# Altium schematic sheet TIDA-010933-DCDC-CLLLC.SchDoc
size 431 x 279 mm; Date: Not shown in title block; ApprovedBy: Not shown in title block; CheckedBy: Not shown in title block; Author: Not shown in title block; CompanyName: Not shown in title block; Engineer: Not shown in title block; Organization: Not shown in title block; Address1: Not shown in title block; Address2: Not shown in title block; Address3: Not shown in title block; Address4: Not shown in title block; DocumentNumber: 1; Revision: Use project parameter SCH_Rev; SheetNumber: 3; SheetTotal: 11; PageSetup: Record=PageOptions|CenterHorizontal=True|CenterVertical=True|PrintScale=1.00|XCorrection=1.00|YCorrection=1.00|PrintKind=0|BorderSize=5000000|LeftOffset=0|BottomOffset=0|Orientation=2|PaperLength=1000|PaperWidth=1000|Scale=100|PaperSource=15|PrintQuality=600|MediaType=1|DitherType=10|PaperKind=Letter|PrintScaleMode=1; CurrentTime: Not shown in title block; CurrentDate: Not shown in title block; Time: Not shown in title block; DocumentFullPathAndName: Not shown in title block; DocumentName: Not shown in title block; ModifiedDate: 1/25/2022; ImagePath: Not shown in title block
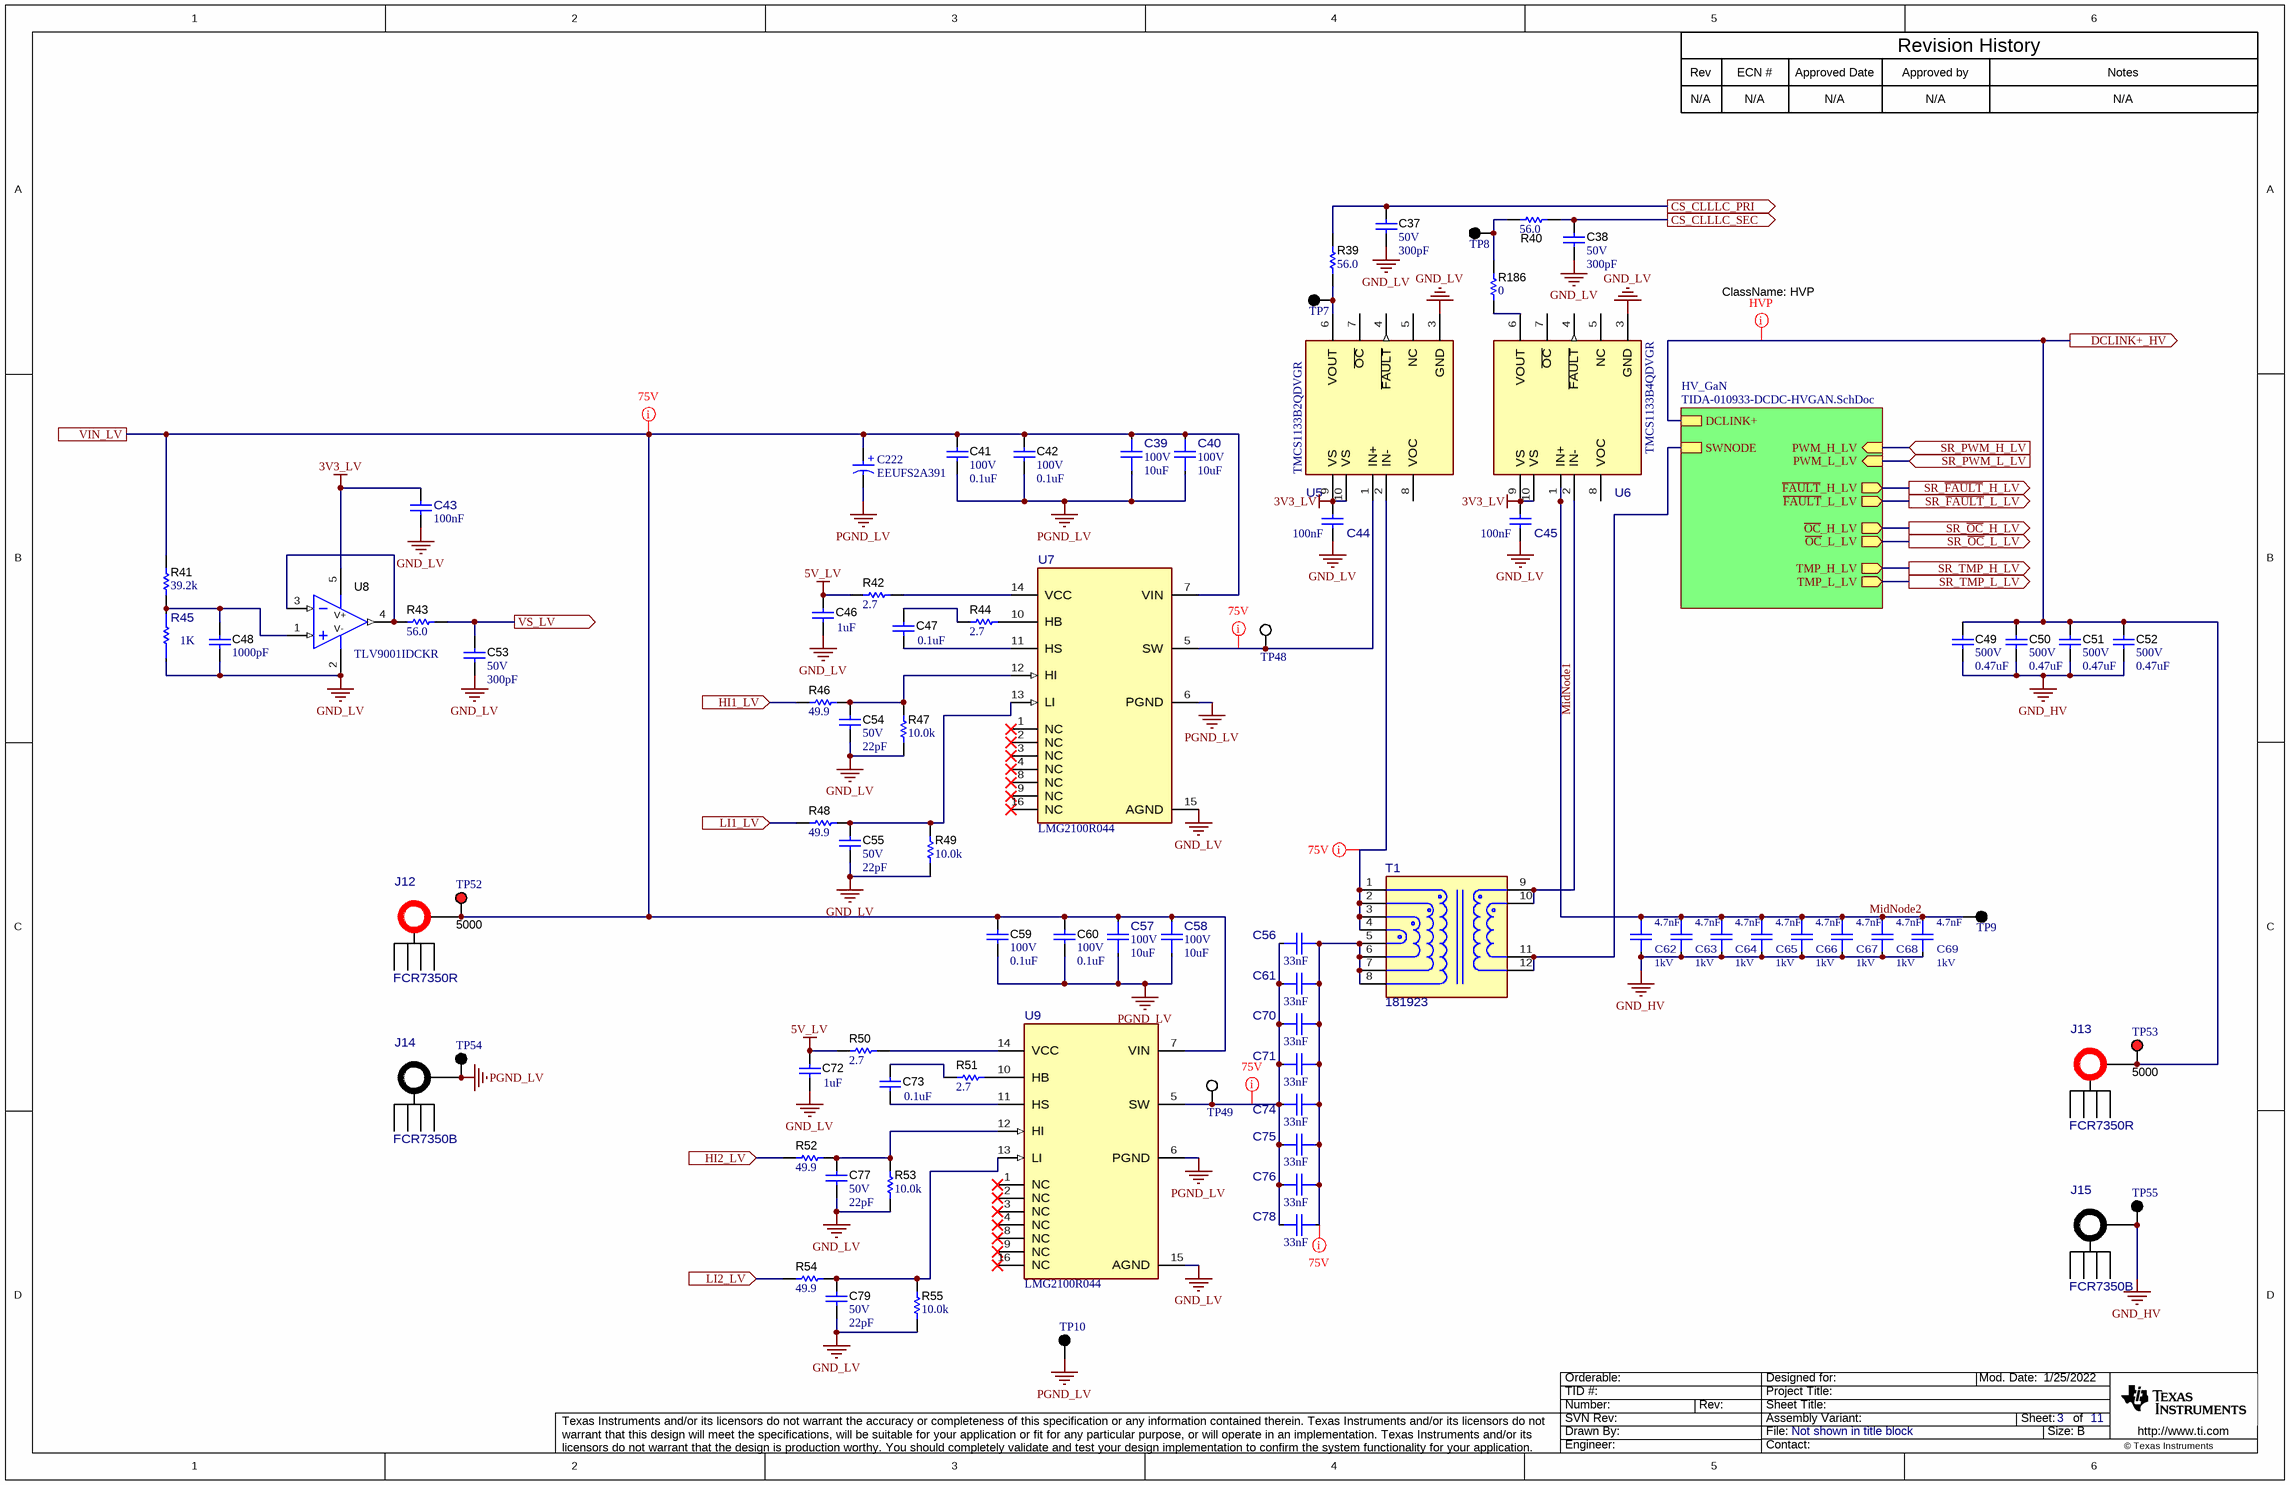
[diagram p0: TIDA-010933-DCDC-CLLLC.SchDoc]

## Parts
C37  VDC_V: 50V  ValueDisplayed: 300pF  [0402]  (hidden comment: GRM1555C1H301JA01D)
C38  VDC_V: 50V  ValueDisplayed: 300pF  [0402]  (hidden comment: GRM1555C1H301JA01D)
C39  VDC_V: 100V  ValueDisplayed: 10uF  [FP-C3225X7R2A106K250AC_1210-MFG]  (hidden comment: C3225X7R2A106K250AC)
C40  VDC_V: 100V  ValueDisplayed: 10uF  [FP-C3225X7R2A106K250AC_1210-MFG]  (hidden comment: C3225X7R2A106K250AC)
C41  VDC_V: 100V  ValueDisplayed: 0.1uF  [0402]  (hidden comment: GRM155R62A104KE14D)
C42  VDC_V: 100V  ValueDisplayed: 0.1uF  [0402]  (hidden comment: GRM155R62A104KE14D)
C43  Cap_F: 100nF  [FP-CL10B104KB8NNNC_0603-IPC_B]  (hidden comment: CL10B104KB8NNNC)
C44  Cap_F: 100nF  [FP-CL10B104KB8NNNC_0603-IPC_B]  (hidden comment: CL10B104KB8NNNC)
C45  Cap_F: 100nF  [FP-CL10B104KB8NNNC_0603-IPC_B]  (hidden comment: CL10B104KB8NNNC)
C46  ValueDisplayed: 1uF  [0402]  (hidden comment: GRM155R61E105KA12D)
C47  ValueDisplayed: 0.1uF  [0402]  (hidden comment: GRM155R71E104KE14D)
C48  ValueDisplayed: 1000pF  [0603]  (hidden comment: CC0603JRNPO8BN102)
C49  VDC_V: 500V  ValueDisplayed: 0.47uF  [1812_254]  (hidden comment: 1812Y5000474KXTWS2)
C50  VDC_V: 500V  ValueDisplayed: 0.47uF  [1812_254]  (hidden comment: 1812Y5000474KXTWS2)
C51  VDC_V: 500V  ValueDisplayed: 0.47uF  [1812_254]  (hidden comment: 1812Y5000474KXTWS2)
C52  VDC_V: 500V  ValueDisplayed: 0.47uF  [1812_254]  (hidden comment: 1812Y5000474KXTWS2)
C53  VDC_V: 50V  ValueDisplayed: 300pF  [0402]  (hidden comment: GRM1555C1H301JA01D)
C54  VDC_V: 50V  ValueDisplayed: 22pF  [0402]  (hidden comment: CC0402JRNPO9BN220)
C55  VDC_V: 50V  ValueDisplayed: 22pF  [0402]  (hidden comment: CC0402JRNPO9BN220)
C56  ValueDisplayed: 33nF  [FP-C3225C0G2A333J200AA_1210-MFG]  (hidden comment: C3225C0G2A333J200AA)
C57  VDC_V: 100V  ValueDisplayed: 10uF  [FP-C3225X7R2A106K250AC_1210-MFG]  (hidden comment: C3225X7R2A106K250AC)
C58  VDC_V: 100V  ValueDisplayed: 10uF  [FP-C3225X7R2A106K250AC_1210-MFG]  (hidden comment: C3225X7R2A106K250AC)
C59  VDC_V: 100V  ValueDisplayed: 0.1uF  [0402]  (hidden comment: GRM155R62A104KE14D)
C60  VDC_V: 100V  ValueDisplayed: 0.1uF  [0402]  (hidden comment: GRM155R62A104KE14D)
C61  ValueDisplayed: 33nF  [FP-C3225C0G2A333J200AA_1210-MFG]  (hidden comment: C3225C0G2A333J200AA)
C62  ValueDisplayed: 4.7nF  VDC_V: 1kV  [FP-C3225C0G3A472J200AC_1210-MFG]  (hidden comment: C3225C0G3A472J200AC)
C63  ValueDisplayed: 4.7nF  VDC_V: 1kV  [FP-C3225C0G3A472J200AC_1210-MFG]  (hidden comment: C3225C0G3A472J200AC)
C64  ValueDisplayed: 4.7nF  VDC_V: 1kV  [FP-C3225C0G3A472J200AC_1210-MFG]  (hidden comment: C3225C0G3A472J200AC)
C65  ValueDisplayed: 4.7nF  VDC_V: 1kV  [FP-C3225C0G3A472J200AC_1210-MFG]  (hidden comment: C3225C0G3A472J200AC)
C66  ValueDisplayed: 4.7nF  VDC_V: 1kV  [FP-C3225C0G3A472J200AC_1210-MFG]  (hidden comment: C3225C0G3A472J200AC)
C67  ValueDisplayed: 4.7nF  VDC_V: 1kV  [FP-C3225C0G3A472J200AC_1210-MFG]  (hidden comment: C3225C0G3A472J200AC)
C68  ValueDisplayed: 4.7nF  VDC_V: 1kV  [FP-C3225C0G3A472J200AC_1210-MFG]  (hidden comment: C3225C0G3A472J200AC)
C69  ValueDisplayed: 4.7nF  VDC_V: 1kV  [FP-C3225C0G3A472J200AC_1210-MFG]  (hidden comment: C3225C0G3A472J200AC)
C70  ValueDisplayed: 33nF  [FP-C3225C0G2A333J200AA_1210-MFG]  (hidden comment: C3225C0G2A333J200AA)
C71  ValueDisplayed: 33nF  [FP-C3225C0G2A333J200AA_1210-MFG]  (hidden comment: C3225C0G2A333J200AA)
C72  ValueDisplayed: 1uF  [0402]  (hidden comment: GRM155R61E105KA12D)
C73  ValueDisplayed: 0.1uF  [0402]  (hidden comment: GRM155R71E104KE14D)
C74  ValueDisplayed: 33nF  [FP-C3225C0G2A333J200AA_1210-MFG]  (hidden comment: C3225C0G2A333J200AA)
C75  ValueDisplayed: 33nF  [FP-C3225C0G2A333J200AA_1210-MFG]  (hidden comment: C3225C0G2A333J200AA)
C76  ValueDisplayed: 33nF  [FP-C3225C0G2A333J200AA_1210-MFG]  (hidden comment: C3225C0G2A333J200AA)
C77  VDC_V: 50V  ValueDisplayed: 22pF  [0402]  (hidden comment: CC0402JRNPO9BN220)
C78  ValueDisplayed: 33nF  [FP-C3225C0G2A333J200AA_1210-MFG]  (hidden comment: C3225C0G2A333J200AA)
C79  VDC_V: 50V  ValueDisplayed: 22pF  [0402]  (hidden comment: CC0402JRNPO9BN220)
C222  EEUFS2A391  [WCAP-ATUL_D16H25]
J12  FCR7350R  [FP-FCR7350R_CONN_BANANA_JACK-MFG]
J13  FCR7350R  [FP-FCR7350R_CONN_BANANA_JACK-MFG]
J14  FCR7350B  [FP-FCR7350B_CONN_BANANA_JACK-MFG]
J15  FCR7350B  [FP-FCR7350B_CONN_BANANA_JACK-MFG]
R39  ValueDisplayed: 56.0  [0603]  (hidden comment: RC0603FR-0756RL)
R40  ValueDisplayed: 56.0  [0603]  (hidden comment: RC0603FR-0756RL)
R41  ValueDisplayed: 39.2k  [0603]  (hidden comment: RT0603BRD0739K2L)
R42  ValueDisplayed: 2.7  [0402]  (hidden comment: CRCW04022R70JNED)
R43  ValueDisplayed: 56.0  [0603]  (hidden comment: RC0603FR-0756RL)
R44  ValueDisplayed: 2.7  [0402]  (hidden comment: CRCW04022R70JNED)
R45  value 1K  [FP-RT0603BRD071KL_0603-MFG]  (hidden comment: RT0603BRD071KL)
R46  ValueDisplayed: 49.9  [0402]  (hidden comment: RC0402FR-0749R9L)
R47  ValueDisplayed: 10.0k  [0402]  (hidden comment: RC0402FR-0710KL)
R48  ValueDisplayed: 49.9  [0402]  (hidden comment: RC0402FR-0749R9L)
R49  ValueDisplayed: 10.0k  [0402]  (hidden comment: RC0402FR-0710KL)
R50  ValueDisplayed: 2.7  [0402]  (hidden comment: CRCW04022R70JNED)
R51  ValueDisplayed: 2.7  [0402]  (hidden comment: CRCW04022R70JNED)
R52  ValueDisplayed: 49.9  [0402]  (hidden comment: RC0402FR-0749R9L)
R53  ValueDisplayed: 10.0k  [0402]  (hidden comment: RC0402FR-0710KL)
R54  ValueDisplayed: 49.9  [0402]  (hidden comment: RC0402FR-0749R9L)
R55  ValueDisplayed: 10.0k  [0402]  (hidden comment: RC0402FR-0710KL)
R186  ValueDisplayed: 0  [0603]  (hidden comment: RC0603JR-070RL)
T1  181923  [FP-181923_PTH_TRANSFORMER_74MM0_60MM0-MFG]
TP7  5001  [Keystone5001]  (value not drawn)
TP8  5001  [Keystone5001]  (value not drawn)
TP9  5001  [Keystone5001]  (value not drawn)
TP10  5001  [Keystone5001]  (value not drawn)
TP48  5015  [Testpoint_Keystone_Miniature]  (value not drawn)
TP49  5015  [Testpoint_Keystone_Miniature]  (value not drawn)
TP52  5000  [Keystone5000]
TP53  5000  [Keystone5000]
TP54  5001  [Keystone5001]  (value not drawn)
TP55  5001  [Keystone5001]  (value not drawn)
U5  TMCS1133B2QDVGR  [DVG0010A-MFG]
U6  TMCS1133B4QDVGR  [DVG0010A-MFG]
U7  LMG2100R044  [VBN0016A-MFG]
U8  TLV9001IDCKR  [DCK0005A_N]
U9  LMG2100R044  [VBN0016A-MFG]

## Sub-sheets
HV_GaN = TIDA-010933-DCDC-HVGAN.SchDoc: SWNODE, DCLINK+, ~{FAULT}_H_LV (out), ~{FAULT}_L_LV (out), ~{OC}_H_LV (out), ~{OC}_L_LV (out), PWM_H_LV (in), PWM_L_LV (in), TMP_H_LV (out), TMP_L_LV (out)

## Ports
CS_CLLLC_PRI (out), CS_CLLLC_SEC (out), DCLINK+_HV (out), HI1_LV (in), HI2_LV (in), LI1_LV (in), LI2_LV (in), SR_PWM_H_LV (in), SR_PWM_L_LV (in), SR_TMP_H_LV (out), SR_TMP_L_LV (out), SR_~{FAULT}_H_LV (out), SR_~{FAULT}_L_LV (out), SR_~{OC}_H_LV (out), SR_~{OC}_L_LV (out), VIN_LV, VS_LV (out)

## Nets
3V3_LV: C43.1 C44.1 C45.1 U5.9(VS) U5.10(VS) U6.9(VS) U6.10(VS) U8.5(V+)
5V_LV: C46.1 C72.1 R42.1 R50.1
GND_HV: C49.2 C50.2 C51.2 C52.2 C62.2 C63.2 C64.2 C65.2 C66.2 C67.2 C68.2 C69.2 J15.1 TP55.1
GND_LV: C37.2 C38.2 C43.2 C44.2 C45.2 C46.2 C48.2 C53.2 C54.2 C55.2 C72.2 C77.2 C79.2 R45.1 R47.1 R49.1 R53.1 R55.1 U5.3(GND) U6.3(GND) U7.15(AGND) U8.2(V-) U9.15(AGND)
PGND_LV: C39.1 C40.1 C41.2 C42.2 C57.1 C58.1 C59.2 C60.2 C222.2(N) J14.1 TP10.1 TP54.1 U7.6(PGND) U9.6(PGND)
CS_CLLLC_PRI: C37.1 R39.2 ; port CS_CLLLC_PRI
CS_CLLLC_SEC: C38.1 R40.1 ; port CS_CLLLC_SEC
DCLINK+_HV: C49.1 C50.1 C51.1 C52.1 J13.1 TP53.1 ; port DCLINK+_HV, sheet HV_GaN/DCLINK+
HI1_LV: R46.1 ; port HI1_LV
HI2_LV: R52.1 ; port HI2_LV
LI1_LV: R48.1 ; port LI1_LV
LI2_LV: R54.1 ; port LI2_LV
MidNode1: T1.9 T1.10 U6.2(IN-)
MidNode2: C62.1 C63.1 C64.1 C65.1 C66.1 C67.1 C68.1 C69.1 TP9.1 U6.1(IN+)
SR_~{FAULT}_H_LV: port SR_~{FAULT}_H_LV, sheet HV_GaN/~{FAULT}_H_LV
SR_~{FAULT}_L_LV: port SR_~{FAULT}_L_LV, sheet HV_GaN/~{FAULT}_L_LV
SR_~{OC}_H_LV: port SR_~{OC}_H_LV, sheet HV_GaN/~{OC}_H_LV
SR_~{OC}_L_LV: port SR_~{OC}_L_LV, sheet HV_GaN/~{OC}_L_LV
SR_PWM_H_LV: port SR_PWM_H_LV, sheet HV_GaN/PWM_H_LV
SR_PWM_L_LV: port SR_PWM_L_LV, sheet HV_GaN/PWM_L_LV
SR_TMP_H_LV: port SR_TMP_H_LV, sheet HV_GaN/TMP_H_LV
SR_TMP_L_LV: port SR_TMP_L_LV, sheet HV_GaN/TMP_L_LV
VIN_LV: C39.2 C40.2 C41.1 C42.1 C57.2 C58.2 C59.1 C60.1 C222.1(P) J12.1 R41.2 TP52.1 U7.7(VIN) U9.7(VIN) ; port VIN_LV
VS_LV: C53.1 R43.2 ; port VS_LV
NetC47_1: C47.1 R44.1
NetC47_2: C47.2 U7.11(HS)
NetC48_1: C48.1 R41.1 R45.2 U8.1(IN+)
NetC54_1: C54.1 R46.2 R47.2 U7.12(HI)
NetC55_1: C55.1 R48.2 R49.2 U7.13(LI)
NetC56_1: C56.1 C61.1 C70.1 C71.1 C74.1 C75.1 C76.1 C78.1 T1.5 T1.6 T1.7 T1.8
NetC56_2: C56.2 C61.2 C70.2 C71.2 C74.2 C75.2 C76.2 C78.2 TP49.1 U9.5(SW)
NetC73_1: C73.1 R51.1
NetC73_2: C73.2 U9.11(HS)
NetC77_1: C77.1 R52.2 R53.2 U9.12(HI)
NetC79_1: C79.1 R54.2 R55.2 U9.13(LI)
NetR39_1: R39.1 TP7.1 U5.6(VOUT)
NetR40_2: R40.2 R186.2 TP8.1
NetR42_2: R42.2 U7.14(VCC)
NetR43_1: R43.1 U8.3(IN-) U8.4(OUT)
NetR44_2: R44.2 U7.10(HB)
NetR50_2: R50.2 U9.14(VCC)
NetR51_2: R51.2 U9.10(HB)
NetR186_1: R186.1 U6.6(VOUT)
NetT1_1: T1.1 T1.2 T1.3 T1.4 U5.2(IN-)
NetT1_11: T1.11 T1.12 ; sheet HV_GaN/SWNODE
NetTP48_1: TP48.1 U5.1(IN+) U7.5(SW)

Not connected (* = marked no-connect by the designer): J12 2(MNT_1) 3(MNT_2) 4(MNT_3) 5(MNT_4); J13 2(MNT_1) 3(MNT_2) 4(MNT_3) 5(MNT_4); J14 2(MNT_1) 3(MNT_2) 4(MNT_3) 5(MNT_4); J15 2(MNT_1) 3(MNT_2) 4(MNT_3) 5(MNT_4); U5 4(~{FAULT}) 5(NC) 7(~{OC}) 8(VOC); U6 4(~{FAULT}) 5(NC) 7(~{OC}) 8(VOC); U7 1(NC)* 2(NC)* 3(NC)* 4(NC)* 8(NC)* 9(NC)* 16(NC)*; U9 1(NC)* 2(NC)* 3(NC)* 4(NC)* 8(NC)* 9(NC)* 16(NC)*

## Layout directives
net class 75V: NetC56_1, NetC56_2, NetT1_1, NetTP48_1, VIN_LV
net class HVP: DCLINK+_HV

## Notes on the sheet
- Rev
- N/A
- ECN #
- Approved Date
- Approved by
- Revision History
- Notes
- Drawn By:
- SVN Rev:
- Number:
- TID #:
- Orderable:
- Rev:
- Sheet Title:
- File:
- Project Title:
- Designed for:
- Assembly Variant:
- Mod. Date:
- Sheet:
- Size:
- of
- B
- http://www.ti.com
- Texas Instruments and/or its licensors do not warrant the accuracy or completeness of this specification or any information contained therein. Texas Instruments and/or its licensors do not warrant that this design will meet the specifications, will be suitable for your application or fit for any particular purpose, or will operate in an implementation. Texas Instruments and/or its licensors do not warrant that the design is production worthy. You should completely validate and test your design implementation to confirm the system functionality for your application.
- Engineer:
- Contact:
- © Texas Instruments
- (in symbol CMP-0116914-1) +

## Library data of the parts
C37 C38 C53 = CMP-0006453-2: CAP, CERM, 300 pF, 50 V, +/- 5%, C0G/NP0, 0402; Manufacturer: MuRata; TaMin_C: -55°C; Polarized: N; SizeAreaWB_mm2: 3; Value1: Unknown; U/M: EA; Value: 300pF; TaMax_C: 125°C; SizeZ_mm: 0.6; SizeX_mm: 1; SizeY_mm: 0.5; AEC Category: Q200; Supplier Part Number 2: 81-GRM1555C1H301JA1D; Publisher: Texas Instruments; Supplier 2: Mouser; TempCo: C0G/NP0; Published: 2008-06-19; RoHS: Y; MountType: SMT; Supplier 1: Digi-Key; PackageReference: 0402; Tolerance_%: 5%; Cap_Case: 0402; Value2: 50V; SizeArea_mm2: 0.5; CompType: Capacitor; LatestRevisionDate: 2017-03-09; PartNumber: GRM1555C1H301JA01D; AEC Qualified: ?; Cap_F: 300pF; ComponentLink1Description: Datasheet link; Supplier Part Number 1: 490-3234-1-ND; Technology: Ceramic; ComponentLink1URL: http://search.murata.co.jp/Ceramy/PnsearchViewAction.do?HnOFG=ON&HnNFG=ON&SEL_CNT=50&sLang=en&sKey=GRM1555C1H301JA01D&x=9&y=9&search=startwith
C39 C40 C57 C58 = CMP-0096021-1: 10 µF ±10% 100V Ceramic Capacitor X7R 1210 (3225 Metric); Manufacturer: TDK; Cap_F: 10µF; AEC Qualified: No; Value: 10µF; SizeZ_mm: 2.85mm; TempCo: 15%; RoHS: TRUE; Digikey Part Number: 445-C3225X7R2A106K250ACCT-ND; Mouser Description: Multilayer Ceramic Chip Capacitors, Capacitance=10µF, LxWxT: 3.2x2.5x2.5mm; Mouser Part Number: 810-C3225X7R2A106K25; Supplier Part Number 1: 445-C3225X7R2A106K250ACCT-ND; Datasheet Path: datasheets/Cap-C3225X7R2A106K250AC.pdf; PackageReference: 1210; Lead Free: Yes; helpURL: https://upverter.com/upn/revision/84742aafcccd6735/; Digikey Description: COMMERCIAL GRADE GENERAL PURPOSE; Tolerance_%: 10%; datasheet: https://product.tdk.com/en/search/capacitor/ceramic/mlcc/info?part_no=C3225X7R2A106K250AC; Part Number: C3225X7R2A106K250AC; Supplier Part Number 2: 810-C3225X7R2A106K25; Operating Temperature Range: -55°C to +125°C; ComponentLink1URL: https://product.tdk.com/en/search/capacitor/ceramic/mlcc/info?part_no=C3225X7R2A106K250AC; Supplier 1: Digikey; Temperature Characteristic: X7R; PartNumber: C3225X7R2A106K250AC; ComponentLink1Description: Datasheet; Supplier 2: Mouser
C41 C42 C59 C60 = CMP-0006618-2: CAP, CERM, 0.1 uF, 100 V, +/- 10%, X5R, 0402; Manufacturer: MuRata; TaMin_C: -55°C; Polarized: N; SizeAreaWB_mm2: 3; Value1: Unknown; U/M: EA; Value: 0.1uF; TaMax_C: 85°C; SizeZ_mm: 0.6; SizeX_mm: 1; SizeY_mm: 0.5; Cap_F: 100nF; AEC Category: Q200; Supplier Part Number 2: 96Y9228; Publisher: Texas Instruments; Supplier 2: Newark; Supplier Part Number 3: 81-GRM155R62A104KE4D; TempCo: X5R; Supplier 3: Mouser; Published: 2008-06-19; RoHS: Y; MountType: SMT; Supplier 1: Digi-Key; PackageReference: 0402; Tolerance_%: 10%; Cap_Case: 0402; Value2: 100V; SizeArea_mm2: 0.5; CompType: Capacitor; LatestRevisionDate: 2017-03-09; PartNumber: GRM155R62A104KE14D; AEC Qualified: N; ComponentLink1Description: Datasheet link; AEC Grade: N/A; Supplier Part Number 1: 490-10458-1-ND; Technology: Ceramic; ComponentLink1URL: http://psearch.en.murata.com/capacitor/product/GRM155R62A104KE14%23.pdf
C43-C45 = CMP-0087079-2: CAP CER 0.1UF 50V X7R 0603; Manufacturer: Samsung; SizeZ_mm: 0.9mm; AEC Qualified: No; TempCo: 15%; Symbol Name: SYM-CL10B104KB8NNNC; Tolerance_%: 10%; ComponentLink1Description: Datasheet; PackageReference: 0603; RoHS: TRUE; ComponentLink1URL: http://www.samsungsem.com/kr/support/product-search/mlcc/__icsFiles/afieldfile/2018/07/24/CL10B104KB8NNNC.pdf; VDC_V: 50V; PartNumber: CL10B104KB8NNNC
C46 C72 = CMP-0006608-2: CAP, CERM, 1 uF, 25 V, +/- 10%, X5R, 0402; Manufacturer: MuRata; TaMin_C: -55°C; Polarized: N; SizeAreaWB_mm2: 3; Value1: Unknown; U/M: EA; Value: 1uF; TaMax_C: 85°C; SizeZ_mm: 0.6; SizeX_mm: 1; SizeY_mm: 0.5; Value2: 25V; Cap_F: 1µF; AEC Category: Q200; Supplier Part Number 2: 48W5730; Publisher: Texas Instruments; Supplier 2: Newark; Supplier Part Number 3: 81-GRM155R61E105KA2D; TempCo: X5R; Supplier 3: Mouser; Published: 2008-06-19; RoHS: Y; MountType: SMT; Supplier 1: Digi-Key; PackageReference: 0402; Tolerance_%: 10%; Cap_Case: 0402; SizeArea_mm2: 0.5; CompType: Capacitor; LatestRevisionDate: 2017-03-09; PartNumber: GRM155R61E105KA12D; AEC Qualified: ?; VDC_V: 25V; ComponentLink1Description: Datasheet link; Supplier Part Number 1: 490-10017-1-ND; Technology: Ceramic; ComponentLink1URL: http://psearch.murata.com/capacitor/product/GRM155R61E105KA12%23.pdf
C47 C73 = CMP-0006659-2: CAP, CERM, 0.1 uF, 25 V, +/- 10%, X7R, 0402; Manufacturer: MuRata; TaMin_C: -55°C; Polarized: N; SizeAreaWB_mm2: 3; Value1: Unknown; U/M: EA; Value: 0.1uF; TaMax_C: 125°C; SizeZ_mm: 0.6; SizeX_mm: 1; SizeY_mm: 0.5; Value2: 25V; Cap_F: 100nF; AEC Category: Q200; Supplier Part Number 2: 31Y1751; Publisher: Texas Instruments; Supplier 2: Newark; Supplier Part Number 3: 81-GRM155R71E104KE4D; TempCo: X7R; Supplier 3: Mouser; Published: 2008-06-19; RoHS: Y; MountType: SMT; Supplier 1: Digi-Key; PackageReference: 0402; Tolerance_%: 10%; Cap_Case: 0402; SizeArea_mm2: 0.5; CompType: Capacitor; LatestRevisionDate: 2017-03-09; PartNumber: GRM155R71E104KE14D; AEC Qualified: N; VDC_V: 25V; ComponentLink1Description: Datasheet link; AEC Grade: N/A; Supplier Part Number 1: 490-10698-1-ND; Technology: Ceramic; ComponentLink1URL: http://search.murata.co.jp/Ceramy/image/img/A01X/G101/ENG/GRM155R71E104KE14-01.pdf
C48 = CMP-0860530-1: CAP, CERM, 1000 pF, 25 V,+/- 5%, C0G/NP0, 0603; Manufacturer: Yageo; SizeX_mm: 1.6; SizeArea_mm2: 1.28; Value: 1000pF; AEC Category: Q200; Cap_F: 1nF; Value2: 25V; Polarized: N; U/M: EA; SizeY_mm: 0.8; SizeZ_mm: 1; TaMax_C: 125°C; TaMin_C: -55°C; SizeAreaWB_mm2: 4.68; AEC Grade: N/A; MountType: SMT; ComponentLink1URL: http://www.yageo.com/documents/recent/UPY-GP_NP0_16V-to-50V_16.pdf; ComponentLink1Description: Datasheet link; PartNumber: CC0603JRNPO8BN102; Cap_Case: 0603; AEC Qualified: N; Technology: Ceramic; CompType: Capacitor; RoHS: Y; PackageReference: 0603; VDC_V: 25V; Tolerance_%: 5%; TempCo: C0G/NP0
C49-C52 = CMP-0009298-2: CAP, CERM, 0.47 uF, 500 V, +/- 10%, X7R, 1812; Manufacturer: Knowles Capacitors; TaMin_C: -55°C; Polarized: N; SizeAreaWB_mm2: 23.1; Value1: Unknown; U/M: EA; Value: 0.47uF; TaMax_C: 125°C; SizeZ_mm: 2.54; SizeX_mm: 4.5; SizeY_mm: 3.2; Cap_Case: 1812; SizeArea_mm2: 14.4; Cap_F: 470nF; AEC Category: Q200; Supplier Part Number 2: 843-1812Y5000474KXS2; Publisher: Texas Instruments; Supplier 2: Mouser; TempCo: X7R; Published: 2008-06-19; RoHS: Y; MountType: SMT; Supplier 1: Digi-Key; PackageReference: 1812; Tolerance_%: 10%; Value2: 500V; CompType: Capacitor; LatestRevisionDate: 2017-03-09; PartNumber: 1812Y5000474KXTWS2; AEC Qualified: N; ComponentLink1Description: Datasheet link; AEC Grade: N/A; Supplier Part Number 1: 1608-1155-1-ND; Technology: Ceramic; ComponentLink1URL: http://www.knowlescapacitors.com/File%20Library/Syfer/English/Product%20Navigation/Product%20Family%20Datasheet/StackiCapDatasheet.pdf
C54 C55 C77 C79 = CMP-0860553-1: CAP, CERM, 22 pF, 50 V,+/- 5%, C0G/NP0, 0402; Manufacturer: Yageo; TaMax_C: 125°C; SizeY_mm: 0.5; SizeZ_mm: 0.6; TaMin_C: -55°C; SizeAreaWB_mm2: 3; SizeX_mm: 1; Polarized: N; Value: 22pF; U/M: EA; AEC Category: Q200; MountType: SMT; PackageReference: 0402; Value2: 50V; AEC Grade: N/A; SizeArea_mm2: 0.5; RoHS: Y; Tolerance_%: 5%; PartNumber: CC0402JRNPO9BN220; TempCo: C0G/NP0; AEC Qualified: N; ComponentLink1Description: Datasheet link; Cap_F: 22pF; CompType: Capacitor; Technology: Ceramic; Cap_Case: 0402; ComponentLink1URL: http://www.yageo.com/documents/recent/UPY-GPHC_X7R_6.3V-to-50V_18.pdf
C56 C61 C70 C71 C74-C76 C78 = CMP-0121244-1: Multilayer Ceramic Capacitors 33nF ±5% 100V C0G SMD 1210; Manufacturer: TDK; AEC Qualified: No; SizeZ_mm: 2.2mm; TempCo: 30ppm/°C; Tolerance_%: 0.05%; Cap_F: 33nF; PackageReference: 1210; PartNumber: C3225C0G2A333J200AA; RoHS: TRUE; VDC_V: 100V; Part Number: C3225C0G2A333J200AA; datasheet: https://product.tdk.com/en/search/capacitor/ceramic/mlcc/info?part_no=C3225C0G2A333J200AA; Datasheet Path: datasheets/Cap-C3225C0G2A333J200AA.pdf; helpURL: https://upverter.com/upn/revision/23a1a33572d5afb0/; Lead Free: Yes; Operating Temperature Range: -55°C to +125°C; Temperature Characteristic: C0G; Value: 33nF; ComponentLink1Description: Datasheet; ComponentLink1URL: https://product.tdk.com/en/search/capacitor/ceramic/mlcc/info?part_no=C3225C0G2A333J200AA
C62-C69 = CMP-0121422-1: Multilayer Ceramic Capacitors 4.7nF ±5% 1000V C0G SMD 1210; Manufacturer: TDK; AEC Qualified: No; SizeZ_mm: 2.2mm; TempCo: 30ppm/°C; Tolerance_%: 0.05%; Cap_F: 4.7nF; PackageReference: 1210; PartNumber: C3225C0G3A472J200AC; RoHS: TRUE; Part Number: C3225C0G3A472J200AC; datasheet: https://product.tdk.com/en/search/capacitor/ceramic/mlcc/info?part_no=C3225C0G3A472J200AC; Datasheet Path: datasheets/Cap-C3225C0G3A472J200AC.pdf; helpURL: https://upverter.com/upn/revision/98040c174d623327/; Lead Free: Yes; Operating Temperature Range: -55°C to +125°C; Temperature Characteristic: C0G; Value: 4.7nF; ComponentLink1Description: Datasheet; ComponentLink1URL: https://product.tdk.com/en/search/capacitor/ceramic/mlcc/info?part_no=C3225C0G3A472J200AC
C222 = CMP-0116914-1: WCAP-ATUL Aluminum Electrolytic Capacitor, Radial, THT, D16 x H25mm, 270µF, 100V; Manufacturer: Panasonic; Capacitance Tolerance: 20%; Dissipation Factor: 9%; Endurance: 10000h; Technical Reference: ATDK250271M100DSPAEK000; Cap_F: 270µF; Category: Aluminum Electrolytic Capacitors; Component Type: Standard; Diameter: 16mm; Height: 25mm; Mount: Through Hole; Operating Temperature Max: 105°C; Operating Temperature Min: -40°C; Packaging: Ammo Pack; Pin Count: 2; Rated Voltage (DC): 100V; Source: Aluminum Electrolytic Capacitors.SchLib; ComponentLink1Description: Website Link; ComponentLink1URL: https://www.we-online.com/redexpert/article/860040880007?ad; ComponentLink2Description: Datasheet Link; ComponentLink2URL: https://www.we-online.com/redexpert/spec/860040880007?ad; PartNumber: EEUFS2A391
J12 J13 = CMP-0032022-2: Banana Jack Connector Standard Banana Solder Red; Manufacturer: CLIFF Electronic Components; ContactFinish: Gold; Current_A: 24A; Voltage_V: 1kV; AEC Qualified: No; Conn Orientation: Horizontal; Is Female: yes; SizeZ_mm: 12.5mm; Standoff Height: 0.7mm; PackageReference: CONN_BANANA_JACK; PartNumber: FCR7350R; PinCount: 1; RoHS: TRUE; Supplier 1: Digikey; Supplier Part Number 1: 4654-FCR7350R-ND; Part Number: FCR7350R; datasheet: https://www.farnell.com/datasheets/3216443.pdf; Datasheet Path: datasheets/Conn-FCR7350R.pdf; Digikey Description: 4MM PANEL SKT S16N-PC RED; Digikey Part Number: 4654-FCR7350R-ND; helpURL: https://upverter.com/upn/revision/ed2a00f5535e7036/; Lead Free: Yes; Operating Temperature Range: -40°C to +80°C; ComponentLink1Description: Datasheet; ComponentLink1URL: https://www.farnell.com/datasheets/3216443.pdf
J14 J15 = CMP-0032021-2: Banana Jack Connector Standard Banana Solder Black; Manufacturer: CLIFF Electronic Components; ContactFinish: Gold; Current_A: 24A; Voltage_V: 1kV; AEC Qualified: No; Conn Orientation: Horizontal; Is Female: yes; SizeZ_mm: 12.5mm; Standoff Height: 0.7mm; PackageReference: CONN_BANANA_JACK; PartNumber: FCR7350B; PinCount: 1; RoHS: TRUE; Supplier 1: Digikey; Supplier Part Number 1: 4654-FCR7350B-ND; Part Number: FCR7350B; datasheet: https://www.cliffuk.co.uk/products/testleads/sockets/fcr7350.pdf; Datasheet Path: datasheets/Conn-FCR7350B.pdf; Digikey Description: 4MM PANEL SKT S16N-PC BLACK; Digikey Part Number: 4654-FCR7350B-ND; helpURL: https://upverter.com/upn/revision/598fb79d4513ed1f/; Lead Free: Yes; Operating Temperature Range: -40°C to +80°C; ComponentLink1Description: Datasheet; ComponentLink1URL: https://www.cliffuk.co.uk/products/testleads/sockets/fcr7350.pdf
R39 R40 R43 = CMP-0023188-5: RES, 56.0, 1%, 0.1 W, 0603; Manufacturer: Yageo; Power_W: 100mW; TempCo: 100 ppm/C; Value_Code: 56R0; Value: 56.0; Res_ohm: 56; SizeX_mm: 1.6; SizeY_mm: 0.8; SizeZ_mm: 1; Value2: 0.1W; SizeArea_mm2: 1.28; AEC Qualified: N; VDC_V: 75V; AEC Category: Q200; SizeAreaWB_mm2: 4.68; Supplier Part Number 2: 603-RC0603FR-0756RL; Supplier 2: Mouser; Supplier Part Number 3: 9238336; Supplier 3: Farnell; RoHS: Y; Value1: 1%; MountType: SMT; Supplier 1: Digi-Key; PackageReference: 0603; Tolerance_%: 1%; CompType: Resistor; PartNumber: RC0603FR-0756RL; ComponentLink1Description: Datasheet link; Supplier Part Number 1: 311-56.0HRCT-ND; Technology: Thick Film; ComponentLink1URL: http://www.yageo.com/pdf/Pu-RC0603_51_PbFree_L_2.pdf; AEC Grade: N/A
R41 = CMP-0024182-3: RES, 39.2 k, 0.1%, 0.1 W, 0603; Manufacturer: Yageo America; Power_W: 100mW; TempCo: 25 ppm/C; Value_Code: 39k2; U/M: EA; Value: 39.2k; EIA_Code: E192; SizeX_mm: 1.6; SizeY_mm: 0.8; SizeZ_mm: 1; Value2: 0.1W; SizeArea_mm2: 1.28; VDC_V: 75V; AEC Category: Q200; Publisher: Texas Instruments; Published: 2008-06-26; RoHS: Y; Value1: 0.1%; MountType: SMT; PackageReference: 0603; Tolerance_%: 0.1%; Res_ohm: 39.2k; CompType: Resistor; LatestRevisionDate: 2017-03-09; PartNumber: RT0603BRD0739K2L; AEC Qualified: ?; ComponentLink1Description: Datasheet link; Technology: Thin Film; ComponentLink1URL: http://www.yageo.com/pdf/PYu-RT_1-to-0.05_RoHS_L_3.pdf
R42 R44 R50 R51 = CMP-0026900-3: RES, 2.7, 5%, 0.063 W, AEC-Q200 Grade 0, 0402; Manufacturer: Vishay-Dale; Power_W: 63mW; TempCo: 200 ppm/C; Value_Code: 2R70; Value: 2.7; EIA_Code: E24; SizeX_mm: 1; SizeY_mm: 0.5; SizeZ_mm: 0.6; Value2: 0.063W; AEC Qualified: Y; VDC_V: 50V; AEC Category: Q200; AEC Grade: 0; Supplier Part Number 2: 71-CRCW04022R70JNED; Supplier 2: Mouser; Supplier Part Number 3: 1739059; Supplier 3: Farnell; RoHS: E; Value1: 5%; MountType: SMT; Supplier 1: Digi-Key; PackageReference: 0402; Tolerance_%: 5%; Res_ohm: 2.7; SizeArea_mm2: 0.5; CompType: Resistor; PartNumber: CRCW04022R70JNED; ComponentLink1Description: Datasheet link; Supplier Part Number 1: 541-2.7JCT-ND; Technology: Thick Film; ComponentLink1URL: http://www.vishay.com/docs/20035/dcrcwe3.pdf
R45 = CMP-0088560-2: High Precision-High Stability Chip Resistor Thin Film 0603 1kOhm 0.1% Paper T/R; Manufacturer: Yageo; SizeZ_mm: 0.55mm; TempCo: 25ppm/°C; Power_W: 100mW; AEC Qualified: No; VDC_V: 75V; Supplier Part Number 2: 603-RT0603BRD071KL; Operating Temperature Range: -55°C to +155°C; datasheet: https://www.yageo.com/upload/media/product/productsearch/datasheet/rchip/PYu-RT_1-to-0.01_RoHS_L_11.pdf; Datasheet Path: datasheets/Res-RT0603BRD071KL.pdf; Digikey Description: RES SMD 1K OHM 0.1% 1/10W 0603; Res_ohm: 1k; Technology: Thin Film; Digikey Part Number: YAG1237CT-ND; helpURL: https://upverter.com/upn/revision/19579a1f39bf24ca/; Supplier 1: Digikey; Supplier 2: Mouser; PackageReference: 0603; Lead Free: Yes; ComponentLink1URL: https://www.yageo.com/upload/media/product/productsearch/datasheet/rchip/PYu-RT_1-to-0.01_RoHS_L_11.pdf; Tolerance_%: 0.1%; Supplier Part Number 1: YAG1237CT-ND; Part Number: RT0603BRD071KL; Series: RT; Mouser Part Number: 603-RT0603BRD071KL; ComponentLink1Description: Datasheet; RoHS: TRUE
R46 R48 R52 R54 = CMP-0026738-1: RES, 49.9, 1%, 0.063 W, 0402; Manufacturer: Yageo America; Power_W: 63mW; TempCo: 100 ppm/C; Value_Code: 49R9; U/M: EA; Value: 49.9; EIA_Code: E96; SizeX_mm: 1; SizeY_mm: 0.5; SizeZ_mm: 0.6; Value2: 0.063W; AEC Qualified: N; VDC_V: 50V; AEC Category: Q200; ComponentLink1URL: http://www.yageo.com/documents/recent/PYu-RC_Group_51_RoHS_L_1.pdf; Supplier Part Number 2: 67R9942; Publisher: Texas Instruments; Supplier 2: Newark; Supplier Part Number 3: 603-RC0402FR-0749R9L; Supplier 3: Mouser; Published: 2008-06-26; RoHS: Y; Value1: 1%; MountType: SMT; Supplier 1: Digi-Key; PackageReference: 0402; Tolerance_%: 1%; Res_ohm: 49.9; SizeArea_mm2: 0.5; CompType: Resistor; LatestRevisionDate: 2017-03-09; PartNumber: RC0402FR-0749R9L; ComponentLink1Description: Datasheet link; AEC Grade: N/A; Supplier Part Number 1: 311-49.9LRCT-ND; Technology: Thick Film
R47 R49 R53 R55 = CMP-0078669-1: RES, 10.0 k, 1%, 0.063 W, 0402; Manufacturer: Yageo America; Power_W: 63mW; Green_Lifecycle: Active; TempCo: 100 ppm/C; Value_Code: 10k0; Green_REACh: Passed; Value: 10.0k; EIA_Code: E96; Res_ohm: 10k; SizeX_mm: 1; SizeY_mm: 0.5; SizeZ_mm: 0.6; Value2: 0.063W; AEC Qualified: N; AEC Category: Q200; ComponentLink1URL: http://www.yageo.com/documents/recent/PYu-RC_Group_51_RoHS_L_8.pdf; Supplier Part Number 2: 98K7499; Supplier 2: Newark; Supplier Part Number 3: 603-RC0402FR-0710KL; Supplier 3: Mouser; RoHS: Y; Value1: 1%; MountType: SMT; Green_EU RoHS-2: Passed; Supplier 1: Digi-Key; Green_EU RoHS: Passed with Exemption; PackageReference: 0402; Tolerance_%: 1%; SizeArea_mm2: 0.5; CompType: Resistor; PartNumber: RC0402FR-0710KL; ComponentLink1Description: Datasheet link; AEC Grade: N/A; Supplier Part Number 1: 311-10.0KLRCT-ND; Technology: Thick Film
R186 = CMP-0025885-5: RES, 0, 5%, 0.1 W, 0603; Manufacturer: Yageo; Power_W: 100mW; TempCo: 200 ppm/C; Value_Code: 0000; Value: 0; EIA_Code: E24; SizeX_mm: 1.6; SizeZ_mm: 1; Value2: 0.1W; SizeArea_mm2: 1.28; AEC Qualified: N; VDC_V: 75V; AEC Category: Q200; SizeY_mm: 0.8; SizeAreaWB_mm2: 4.68; Supplier Part Number 2: 603-RC0603JR-070RL; Supplier 2: Mouser; Supplier Part Number 3: 9233130; Supplier 3: Farnell; RoHS: Y; Value1: 5%; MountType: SMT; Supplier 1: Digi-Key; PackageReference: 0603; Tolerance_%: 5%; Res_ohm: 0; CompType: Resistor; PartNumber: RC0603JR-070RL; ComponentLink1Description: Datasheet link; Supplier Part Number 1: 311-0.0GRCT-ND; Technology: Thick Film; ComponentLink1URL: http://www.yageo.com/pdf/Pu-RC0603_51_PbFree_L_2.pdf; AEC Grade: N/A
T1 = CMP-0121418-1: TRANSFORMER; Manufacturer: Bourns; Ind_H: 6µH; Ns1toNp: 3:8; SizeZ_mm: 28mm; AEC Qualified: No; PackageReference: PTH_TRANSFORMER_74MM0_60MM0; PartNumber: 181923; RoHS: TRUE; Part Number: 181923; Datasheet Path: datasheets/Trans-181923.pdf; helpURL: https://upverter.com/upn/revision/4416aa2755af3085/; Lead Free: Yes; Operating Temperature Range: -40°C to +125°C
TP7-TP10 TP54 TP55 = CMP-0055138-2: Test Point, Miniature, Black, TH; Manufacturer: Keystone Electronics; ContactFinish: Silver; CNHeader: FALSE; Green_Lifecycle: Active; Green_REACh: Passed; CT: TRUE; Color: Black; PackageReference: Black Miniature Testpoint; LatestRevisionDate: 26/05/2017; MountType: TH; Publisher: Texas Instruments; Green_EU RoHS-2: Incomplete; PartNumber: 5001; Supplier 1: Digi-Key; Supplier Part Number 1: 36-5001-ND; ComponentLink1URL: http://www.keyelco.com/userAssets/file/M60-2p60.pdf; ComponentLink1Description: Datasheet URL; RoHS: Y; Supplier 2: Mouser; Green_EU RoHS: Passed; CompType: Test Point; Supplier Part Number 2: 534-5001
TP48 TP49 = CMP-0055152-2: Test Point, Miniature, SMT; Manufacturer: Keystone Electronics; CT: TRUE; Green_Lifecycle: Active; Green_REACh: Passed; CNHeader: FALSE; Supplier Part Number 2: 534-5015; PartNumber: 5015; ComponentLink1URL: http://www.keyelco.com/userAssets/store/files/5015.PDF; MountType: SMT; PackageReference: Testpoint_Keystone_Miniature; Green_EU RoHS-2: Incomplete; Publisher: Texas Instruments; CompType: Test Point; RoHS: Y; Green_EU RoHS: Passed; Supplier 1: Digi-Key; Supplier 2: Mouser; ComponentLink1Description: Datasheet URL; LatestRevisionDate: 26/05/2017; Supplier Part Number 1: 36-5015TR-ND
TP52 TP53 = CMP-0055137-2: Test Point, Miniature, Red, TH; Manufacturer: Keystone Electronics; Green_REACh: Passed; Green_Lifecycle: Active; ContactFinish: Silver; CNHeader: FALSE; CT: TRUE; Green_EU RoHS-2: Incomplete; Supplier 2: Mouser; PackageReference: Red Miniature Testpoint; MountType: TH; PartNumber: 5000; LatestRevisionDate: 26/05/2017; RoHS: Y; Publisher: Texas Instruments; ComponentLink1URL: http://www.keyelco.com/userAssets/file/M60-2p60.pdf; ComponentLink1Description: Datasheet URL; CompType: Test Point; Supplier Part Number 1: 36-5000-ND; Supplier 1: Digi-Key; Green_EU RoHS: Passed; Color: Red; Supplier Part Number 2: 534-5000
U5 = CMP-0097985-1: Manufacturer: Texas Instruments; SizeZ_mm: 2.65mm; Standoff Height: 0.1mm; RoHS: UNKNOWN; PackageReference: SOIC10; PartNumber: TMCS1133B2QDVGR; helpURL: https://upverter.com/upn/revision/bf50284191f03d6c/; Datasheet Path: datasheets/IC-TMCS1133B2QDVGR.pdf; Operating Temperature Range: to; Part Number: TMCS1133B2QDVGR
U6 = CMP-0097987-1: Manufacturer: Texas Instruments; Standoff Height: 0.1mm; SizeZ_mm: 2.65mm; Datasheet Path: datasheets/IC-TMCS1133B4QDVGR.pdf; RoHS: UNKNOWN; Operating Temperature Range: to; helpURL: https://upverter.com/upn/revision/ca2288f0ac17ff21/; PackageReference: SOIC10; PartNumber: TMCS1133B4QDVGR; Part Number: TMCS1133B4QDVGR
U7 U9 = CMP-0120692-1: 100-V, 53-A GaN Half-Bridge Power Stage; Manufacturer: Texas Instruments; SizeZ_mm: 0.85mm; AEC Qualified: No; Max Supply Voltage: 5.25V; Min Supply Voltage: 4.75V; Nominal Supply Current: 12mA; Number Of Outputs: 1; Standoff Height: 0mm; TJmax_C: +125°C; PackageReference: VQFN-FCRLF16; PartNumber: LMG2100R044; RoHS: UNKNOWN; Operating Temperature Range: -40°C to +125°C; Part Number: LMG2100R044; helpURL: https://upverter.com/upn/revision/6cbafed2923246a8/
U8 = CMP-0081556-1: Low-Power, Rail-to-Rail In and Out, 1-MHz Operational Amplifier, DCK0005A (SOT-SC70-5); Alternate PartNumber: TLV9001IDCKT; Alternate Manufacturer: Texas Instruments; SizeAreaWB_mm2: 9.3; SizeZ_mm: 1.1; SizeX_mm: 2.1; SizeY_mm: 2; SizeArea_mm2: 4.2; CompType: IC; AEC Qualified: N; AEC Category: Q200; ComponentLink1URL: http://www.ti.com/lit/ds/symlink/tlv9001.pdf; PackageDescription: SOT-SC70-5; MountType: SMT; ComponentLink2URL: http://www.ti.com/product/tlv9001; ComponentLink3Description: Online Datasheet; ComponentLink2Description: Product Folder; Manufacturer: Texas Instruments; ComponentLink3URL: http://www.ti.com/product/tlv9001/datasheet; PackageReference: DCK0005A; PartNumber: TLV9001IDCKR; ComponentLink1Description: Datasheet Link